# Altium schematic sheet M2.SchDoc
size A3; SheetNumber: 1; SheetTotal: 1; PageSetup: Record=PageOptions|CenterHorizontal=True|CenterVertical=True|PrintScale=0.97|XCorrection=1.00|YCorrection=1.00|PrintKind=1|BorderSize=5000000|LeftOffset=0|BottomOffset=0|Orientation=2|PaperLength=2970|PaperWidth=2100|Scale=100|PaperSource=7|PrintQuality=600|MediaType=1|DitherType=10|PaperKind=A4|PrintScaleMode=1
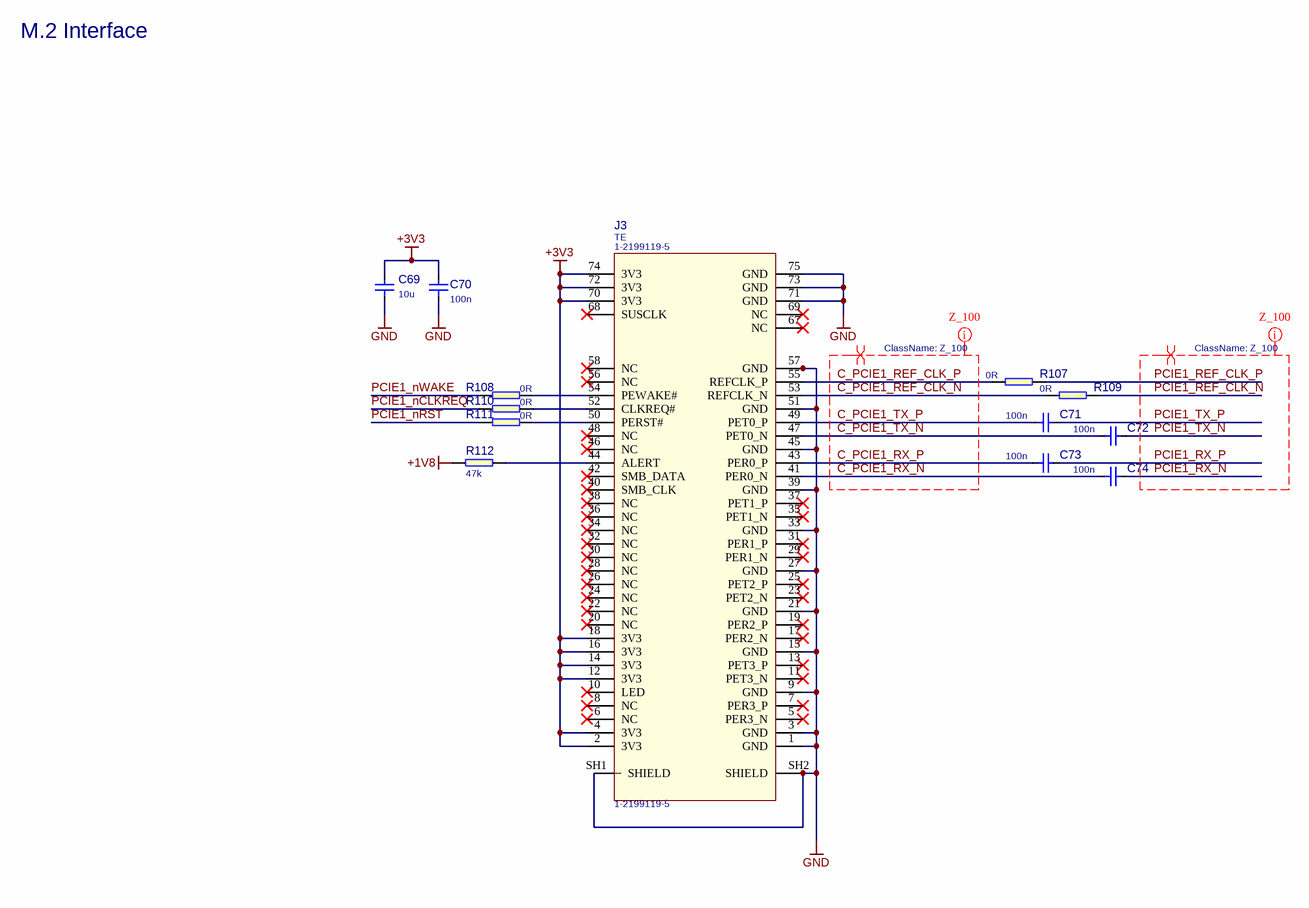
[diagram p0: M2.SchDoc]

## Parts
C69  10u  [0805]
C70  100n  [C_0402]
C71  100n  [C_0402]
C72  100n  [C_0402]
C73  100n  [C_0402]
C74  100n  [C_0402]
J3  1-2199119-5  Manufacturer: TE  [1-2199119-5]
R107  0R  [0402]
R108  0R  [0402]
R109  0R  [0402]
R110  0R  [0402]
R111  0R  [0402]
R112  47k  [0402]

## Nets
+1V8: R112.2
+3V3: C69.2 C70.2 J3.2(3V3) J3.4(3V3) J3.12(3V3) J3.14(3V3) J3.16(3V3) J3.18(3V3) J3.70(3V3) J3.72(3V3) J3.74(3V3)
GND: C69.1 C70.1 J3.1(GND) J3.3(GND) J3.9(GND) J3.15(GND) J3.21(GND) J3.27(GND) J3.33(GND) J3.39(GND) J3.45(GND) J3.51(GND) J3.57(GND) J3.71(GND) J3.73(GND) J3.75(GND) J3.SH1(SHIELD) J3.SH2(SHIELD)
C_PCIE1_REF_CLK_N: J3.53(REFCLK_N) R109.1
C_PCIE1_REF_CLK_P: J3.55(REFCLK_P) R107.1
C_PCIE1_RX_N: C74.1 J3.41(PER0_N)
C_PCIE1_RX_P: C73.1 J3.43(PER0_P)
C_PCIE1_TX_N: C72.1 J3.47(PET0_N)
C_PCIE1_TX_P: C71.1 J3.49(PET0_P)
PCIE1_nCLKREQ: R110.1
PCIE1_nRST: R111.1
PCIE1_nWAKE: R108.1
PCIE1_REF_CLK_N: R109.2
PCIE1_REF_CLK_P: R107.2
PCIE1_RX_N: C74.2
PCIE1_RX_P: C73.2
PCIE1_TX_N: C72.2
PCIE1_TX_P: C71.2
NetJ3_44: J3.44(ALERT) R112.1
NetJ3_50: J3.50(PERST#) R111.2
NetJ3_52: J3.52(CLKREQ#) R110.2
NetJ3_54: J3.54(PEWAKE#) R108.2

Not connected (* = marked no-connect by the designer): J3 5(PER3_N)* 6(NC)* 7(PER3_P)* 8(NC)* 10(LED)* 11(PET3_N)* 13(PET3_P)* 17(PER2_N)* 19(PER2_P)* 20(NC)* 22(NC)* 23(PET2_N)* 24(NC)* 25(PET2_P)* 26(NC)* 28(NC)* 29(PER1_N)* 30(NC)* 31(PER1_P)* 32(NC)* 34(NC)* 35(PET1_N)* 36(NC)* 37(PET1_P)* 38(NC)* 40(SMB_CLK)* 42(SMB_DATA)* 46(NC)* 48(NC)* 56(NC)* 58(NC)* 67(NC)* 68(SUSCLK)* 69(NC)*

## Layout directives
net class Z_100: C_PCIE1_REF_CLK_N, C_PCIE1_REF_CLK_P, C_PCIE1_RX_N, C_PCIE1_RX_P, C_PCIE1_TX_N, C_PCIE1_TX_P, PCIE1_REF_CLK_N, PCIE1_REF_CLK_P, PCIE1_RX_N, PCIE1_RX_P, PCIE1_TX_N, PCIE1_TX_P
differential pair: C_PCIE1_REF_CLK_N, C_PCIE1_REF_CLK_P, C_PCIE1_RX_N, C_PCIE1_RX_P, C_PCIE1_TX_N, C_PCIE1_TX_P, PCIE1_REF_CLK_N, PCIE1_REF_CLK_P, PCIE1_RX_N, PCIE1_RX_P, PCIE1_TX_N, PCIE1_TX_P

## Notes on the sheet
- M.2 Interface
- Title:
- Size:
- Date:
- Status:
- A3
- Revision:
- Page:
- of
- Antmicro Ltd
- www.antmicro.com
- File:

## Library data of the parts
C69 = C_10u_0805: MLCC SMT Capacitor 10uF 0805; PartNumber: C_10u_0805; Value: 10u
C70-C74 = C_100n_0402: MLCC SMT Capacitor 100nF 0402; PartNumber: C_100n_0402; Value: 100n
J3 = 1-2199119-5: CONN FEMALE 67POS 0.020 GOLD; PartNumber: 1-2199119-5; Value: 1-2199119-5
R107-R111 = R_0R_0402: SMT Resistor 0402; PartNumber: R_0R_0402; Value: 0R
R112 = R_47k_0402: SMT Resistor 0402; PartNumber: R_47k_0402; Value: 47k